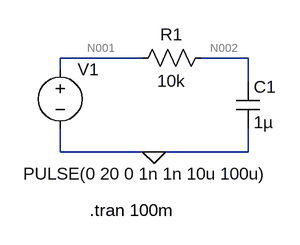
[diagram p0: schematic current_measurement_amplifier_filter.asc]
current_measurement_amplifier_filter.asc, the LTspice schematic file:
Version 4.1
SHEET 1 880 680
WIRE 224 96 112 96
WIRE 368 96 304 96
WIRE 112 112 112 96
WIRE 368 128 368 96
WIRE 112 224 112 192
WIRE 240 224 112 224
WIRE 368 224 368 192
WIRE 368 224 240 224
FLAG 240 224 0
SYMBOL res 320 80 R90
WINDOW 0 0 56 VBottom 2
WINDOW 3 32 56 VTop 2
SYMATTR InstName R1
SYMATTR Value 10k
SYMBOL cap 352 128 R0
SYMATTR InstName C1
SYMATTR Value 1µ
SYMBOL voltage 112 96 R0
WINDOW 3 -50 158 Left 2
WINDOW 123 0 0 Left 0
WINDOW 39 0 0 Left 0
SYMATTR Value PULSE(0 20 0 1n 1n 10u 100u)
SYMATTR InstName V1
TEXT 152 304 Left 2 !.tran 100m

The netlist it stands for:
* current_measurement_amplifier_filter.asc
R1 N002 N001 10k
C1 N002 0 1µ
V1 N001 0 PULSE(0 20 0 1n 1n 10u 100u)
.tran 100m
.backanno
.end

* Results of the author's LTspice run, read from the files saved beside the schematic
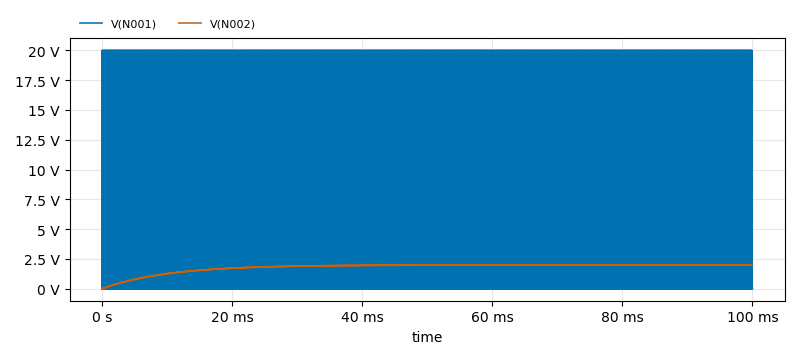
[diagram p1: Transient Analysis of current_measurement_amplifier_filter.asc, plotted from the saved traces]
* Transient Analysis, 1 run:
*   V(N001): min 0 V, max 20 V, average 2 V, rms 6.325 V, last 0 V
*   V(N002): min 0 V, max 2.009 V, average 1.801 V, rms 1.845 V, last 1.991 V